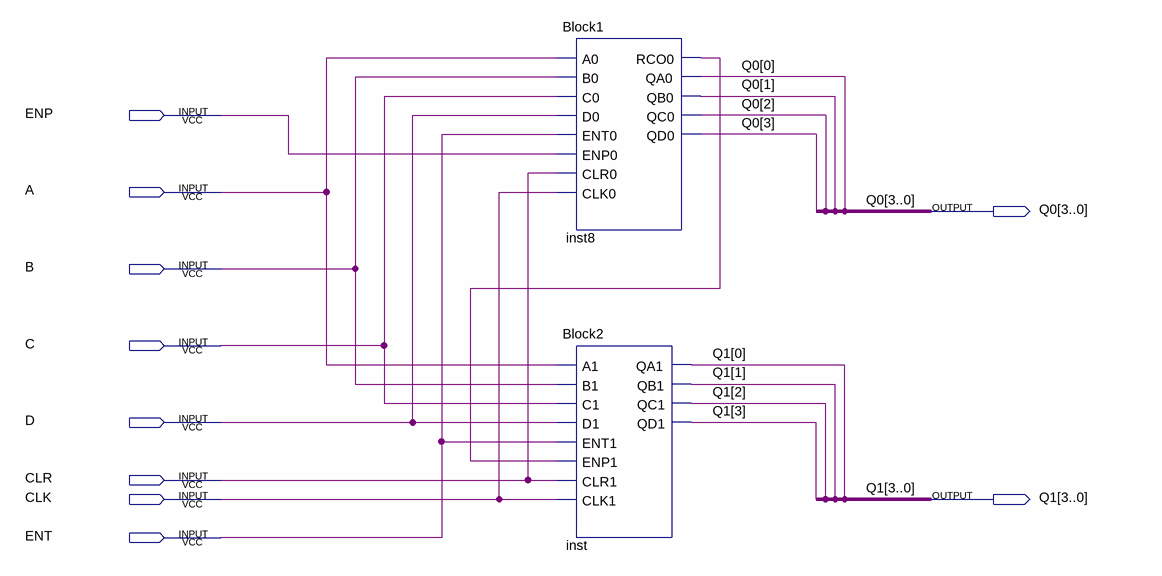
[diagram p0: schematic sheet]
// Quartus schematic Homework.bdf as structural Verilog: 2 symbols, 10 pins
module Homework (
  input  ENP,
  input  A,
  input  B,
  input  C,
  input  D,
  input  CLR,
  input  CLK,
  input  ENT,
  output [3:0] Q0,
  output [3:0] Q1
);

  wire inst8_rco0;

  Block1 inst8 (
    .A0(A), .B0(B), .C0(C), .D0(D), .ENT0(ENT), .ENP0(ENP), .CLR0(CLR), .CLK0(CLK), .RCO0(inst8_rco0),
    .QA0(Q0[0]), .QB0(Q0[1]), .QC0(Q0[2]), .QD0(Q0[3]));
  Block2 inst (
    .A1(A), .B1(B), .C1(C), .D1(D), .ENT1(ENT), .ENP1(inst8_rco0), .CLR1(CLR), .CLK1(CLK), .QA1(Q1[0]),
    .QB1(Q1[1]), .QC1(Q1[2]), .QD1(Q1[3]));
endmodule
